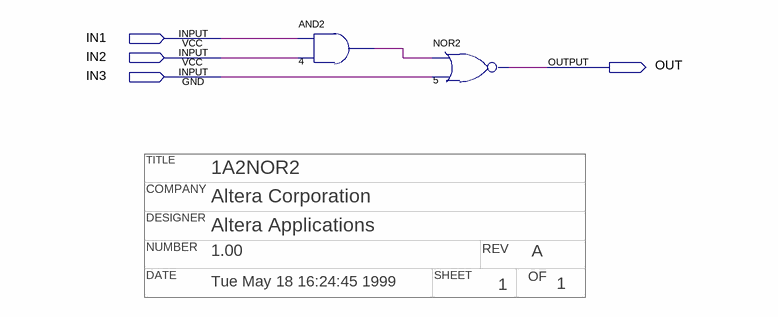
[diagram p0: schematic sheet]
// Quartus schematic 1a2nor2.bdf as structural Verilog: 2 symbols, 4 pins
// Title block: TITLE: 1A2NOR2; COMPANY: Altera Corporation; DESIGNER: Altera Applications; NUMBER: 1.00; REV: A; DATE: Tue May 18 16:24:45 1999; SHEET: 1; OF: 1
module \1a2nor2  (
  input  IN1,
  input  IN2,
  input  IN3,
  output OUT
);

  wire n4_out;

  and u_4 (n4_out, IN1, IN2);
  nor u_5 (OUT, n4_out, IN3);
endmodule
